# Altium project Shuttler_AMC.PrjPcb (part 4 of 20)

## Sheet POWER_Management.SchDoc: =ProjectName
size 420 x 297 mm; Author: T.P.; CompanyName: WUT; DrawnBy: T.P.; Organization: WUT ISE; Address1: Warsaw Univeristy of Technology; Address2: Nowowiejska 15/19; DocumentNumber: 24; Revision: 0.9; SheetNumber: 24; SheetTotal: 36; EDA_Number: ARTIQ; Projet: ARTIQ/SINARA; ModifiedBy: -; CreateDate: XX/XX/XXXX; CheckedDate: -; Title2: POWER_Management.SchDoc; DivGrp: ISE; Designer: G.K. and T.P.; ModifiedDate: -; ProjectName: ADC/DAC MEZZANINE
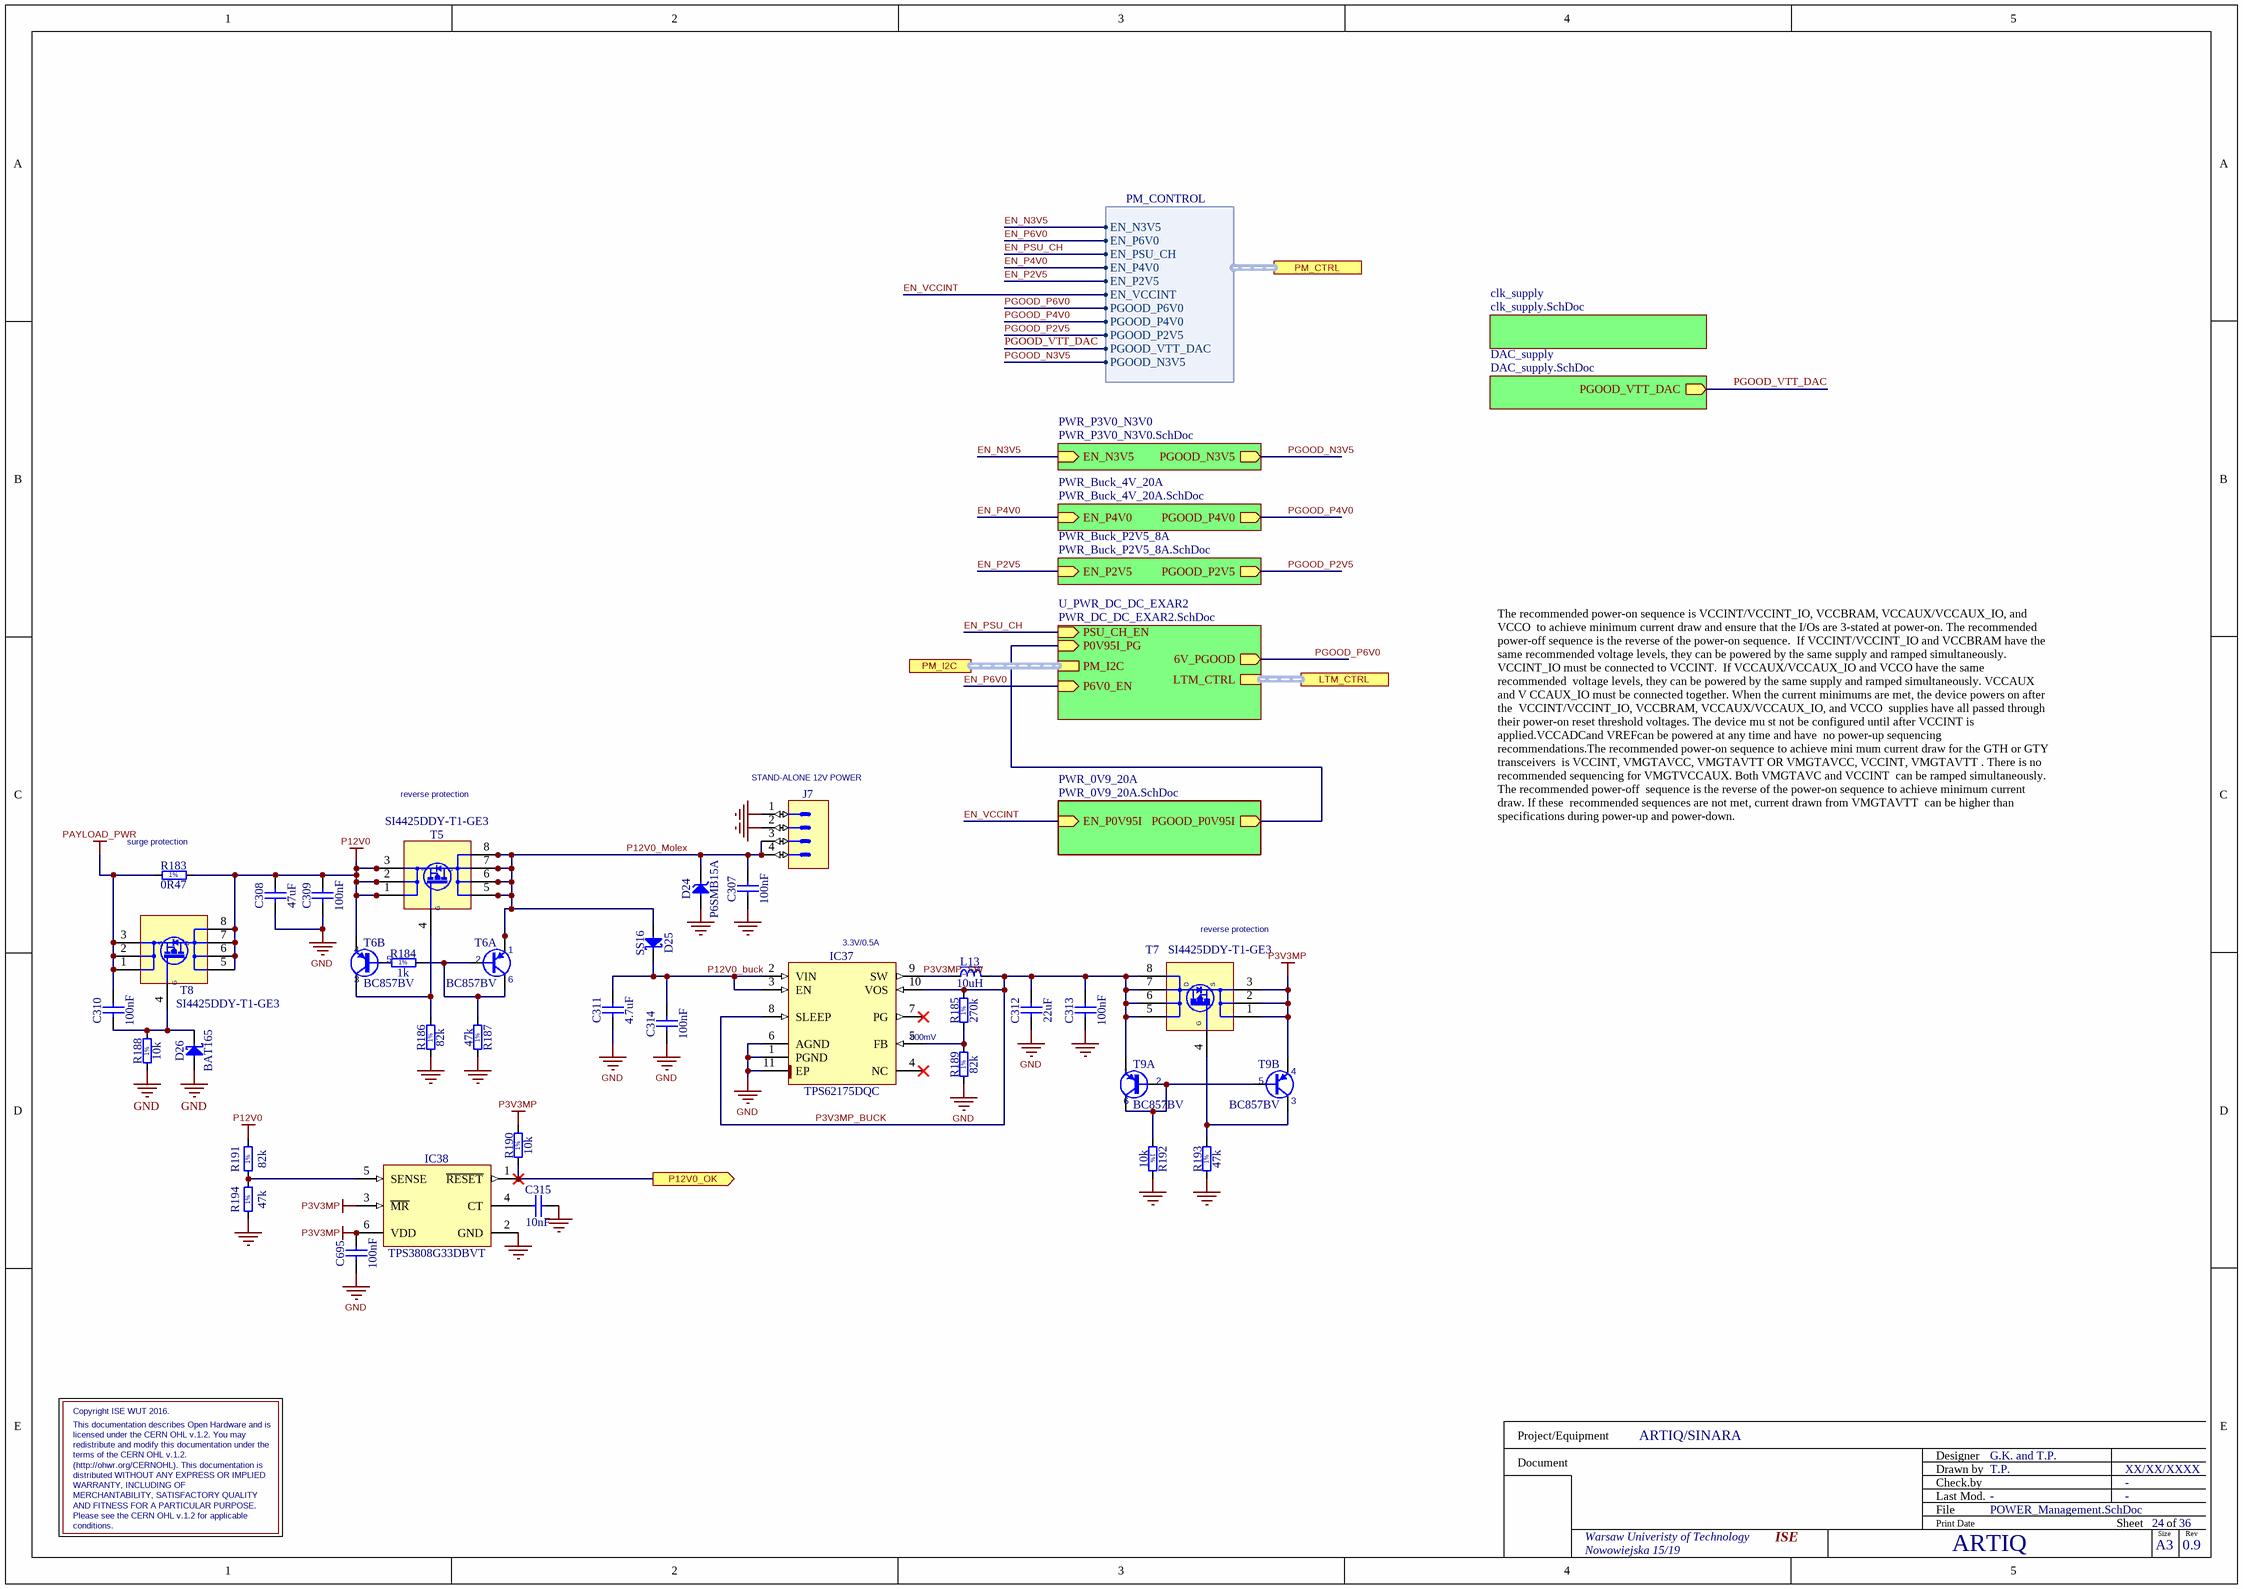
[diagram p5: POWER_Management.SchDoc]

### Parts
C307  100nF  [CAPC1005X55N]
C308  47uF  [CAPC3216X180N]
C309  100nF  [CAPC1005X55N]
C310  100nF  [CAPC1005X55N]
C311  4.7uF  [CAPC1709X95N]
C312  22uF  [CAPC2012X135N]
C313  100nF  [CAPC1005X55N]
C314  100nF  [CAPC1005X55N]
C315  10nF  [CAPC1005X55N]
C695  100nF  [CAPC1005X55N]
D24  P6SMB15A  [DIOM5436X261N]
D25  SS16  [DIOM5127X229N]
D26  BAT165  [SOD2512X110N]
IC37  TPS62175DQC  [SON50P200X300X80-11N-R94X250]
IC38  TPS3808G33DBVT  [SOT95P280X145-6N]
J7  Mini-Fit Jr.™  [MOLEX_39-28-1043]  (value not drawn)
L13  10uH  [IND_MURATA-PS_8400]
R183  0R47  [RESC3216X65N]
R184  1k  [RESC1005X40N]
R185  270k  [RESC1005X40N]
R186  82k  [RESC1005X40N]
R187  47k  [RESC1005X40N]
R188  10k  [RESC1005X40N]
R189  82k  [RESC1005X40N]
R190  10k  [RESC1005X40N]
R191  82k  [RESC1005X40N]
R192  10k  [RESC1005X40N]
R193  47k  [RESC1005X40N]
R194  47k  [RESC1005X40N]
T5  SI4425DDY-T1-GE3  [SOIC127P600X175-8N]
T6  BC857BV  [SOTFL50P160X60-6N]  (parts A,B of 2)
T7  SI4425DDY-T1-GE3  [SOIC127P600X175-8N]
T8  SI4425DDY-T1-GE3  [SOIC127P600X175-8N]
T9  BC857BV  [SOTFL50P160X60-6N]  (parts A,B of 2)

### Sub-sheets
clk_supply = clk_supply.SchDoc: no entries
DAC_supply = DAC_supply.SchDoc: PGOOD_VTT_DAC (out)
PWR_0V9_20A = PWR_0V9_20A.SchDoc: PGOOD_P0V95I (out), EN_P0V95I (in)  | CmpIndex: 17; SymIndex: 784
PWR_Buck_4V_20A = PWR_Buck_4V_20A.SchDoc: EN_P4V0 (in), PGOOD_P4V0 (out)
PWR_Buck_P2V5_8A = PWR_Buck_P2V5_8A.SchDoc: PGOOD_P2V5 (out), EN_P2V5 (in)
PWR_P3V0_N3V0 = PWR_P3V0_N3V0.SchDoc: PGOOD_N3V5 (out), EN_N3V5 (in)
U_PWR_DC_DC_EXAR2 = PWR_DC_DC_EXAR2.SchDoc: P0V95I_PG (in), PSU_CH_EN (in), LTM_CTRL (harness LTM_CTRL), PM_I2C (harness I2C), 6V_PGOOD (out), P6V0_EN (in)

### Ports
LTM_CTRL (harness LTM_CTRL), P12V0_OK (out), PM_CTRL (harness PM_CONTROL), PM_I2C (harness I2C)

### Harnesses
PM_CONTROL: EN_P6V0, EN_PSU_CH, EN_VCCINT, PGOOD_P6V0, EN_P2V5, EN_P4V0, PGOOD_P4V0, PGOOD_P2V5, PGOOD_VTT_DAC, EN_N3V5, PGOOD_N3V5

### Nets
GND: C307.1 C308.1 C309.1 C311.1 C312.1 C313.1 C314.1 C315.1 C695.1 D24.2(A) D26.2(A) IC37.1(PGND) IC37.6(AGND) IC37.11(EP) IC38.2(GND) J7.1 J7.2 R186.1 R187.1 R188.1 R189.1 R192.2 R193.1 R194.1
P3V3MP: C695.2 IC38.3(~{MR}) IC38.6(VDD) R190.2 T7.1(S) T7.2(S) T7.3(S) T9.4(E)
P12V0: C308.2 C309.2 R183.2 R191.2 T5.1(S) T5.2(S) T5.3(S) T6.4(E) T8.5(D) T8.6(D) T8.7(D) T8.8(D)
PAYLOAD_PWR: C310.2 R183.1 T8.1(S) T8.2(S) T8.3(S)
EN_N3V5: sheet PWR_P3V0_N3V0/EN_N3V5, port PM_CTRL.EN_N3V5
EN_P2V5: sheet PWR_Buck_P2V5_8A/EN_P2V5, port PM_CTRL.EN_P2V5
EN_P4V0: sheet PWR_Buck_4V_20A/EN_P4V0, port PM_CTRL.EN_P4V0
EN_P6V0: sheet U_PWR_DC_DC_EXAR2/P6V0_EN, port PM_CTRL.EN_P6V0
EN_PSU_CH: sheet U_PWR_DC_DC_EXAR2/PSU_CH_EN, port PM_CTRL.EN_PSU_CH
EN_VCCINT: sheet PWR_0V9_20A/EN_P0V95I, port PM_CTRL.EN_VCCINT
P0V95I_PG: sheet PWR_0V9_20A/PGOOD_P0V95I, sheet U_PWR_DC_DC_EXAR2/P0V95I_PG
P3V3MP_BUCK: C312.2 C313.2 IC37.8(SLEEP) IC37.10(VOS) L13.2 R185.2 T7.5(D) T7.6(D) T7.7(D) T7.8(D) T9.1(E)
P3V3MP_SW: IC37.9(SW) L13.1
P12V0_buck: C311.2 C314.2 D25.1(C) IC37.2(VIN) IC37.3(EN)
P12V0_Molex: C307.2 D24.1(C) D25.2(A) J7.3 J7.4 T5.5(D) T5.6(D) T5.7(D) T5.8(D) T6.1(E)
P12V0_OK: IC38.1(~{RESET}) R190.1 ; port P12V0_OK
PGOOD_N3V5: sheet PWR_P3V0_N3V0/PGOOD_N3V5, port PM_CTRL.PGOOD_N3V5
PGOOD_P2V5: sheet PWR_Buck_P2V5_8A/PGOOD_P2V5, port PM_CTRL.PGOOD_P2V5
PGOOD_P4V0: sheet PWR_Buck_4V_20A/PGOOD_P4V0, port PM_CTRL.PGOOD_P4V0
PGOOD_P6V0: sheet U_PWR_DC_DC_EXAR2/6V_PGOOD, port PM_CTRL.PGOOD_P6V0
PGOOD_VTT_DAC: sheet DAC_supply/PGOOD_VTT_DAC, port PM_CTRL.PGOOD_VTT_DAC
NetC310_1: C310.1 D26.1(C) R188.2 T8.4(S)
NetC315_2: C315.2 IC38.4(CT)
NetIC37_5: IC37.5(FB) R185.1 R189.2
NetIC38_5: IC38.5(SENSE) R191.1 R194.2
NetR184_1: R184.1 T6.5(B)
NetR184_2: R184.2 R187.2 T6.2(B) T6.6(C)
NetR186_2: R186.2 T5.4(S) T6.3(C)
NetR192_1: R192.1 T9.2(B) T9.5(B) T9.6(C)
NetR193_2: R193.2 T7.4(S) T9.3(C)

Not connected (* = marked no-connect by the designer): IC37 4(NC)* 7(PG)*

### Buses and harness runs
harness port LTM_CTRL = sheet U_PWR_DC_DC_EXAR2/LTM_CTRL
harness port PM_I2C = sheet U_PWR_DC_DC_EXAR2/PM_I2C

### Notes on the sheet
- reverse protection
- (near J7) STAND-ALONE 12V POWER
- (near R183) surge protection
- The recommended power-on sequence is VCCINT/VCCINT_IO, VCCBRAM, VCCAUX/VCCAUX_IO, and VCCO  to achieve minimum current draw and ensure that the I/Os are 3-stated at power-on. The recommended  power-off sequence is the reverse of the power-on sequence.  If VCCINT/VCCINT_IO and VCCBRAM have the  same recommended voltage levels, they can be powered by the same supply and ramped simultaneously.  VCCINT_IO must be connected to VCCINT.  If VCCAUX/VCCAUX_IO and VCCO have the same recommended  voltage levels, they can be powered by the same supply and ramped simultaneously. VCCAUX and V CCAUX_IO must be connected together. When the current minimums are met, the device powers on after the  VCCINT/VCCINT_IO, VCCBRAM, VCCAUX/VCCAUX_IO, and VCCO  supplies have all passed through their power-on reset threshold voltages. The device mu st not be configured until after VCCINT is applied.VCCADCand VREFcan be powered at any time and have  no power-up sequencing recommendations.The recommended power-on sequence to achieve mini mum current draw for the GTH or GTY transceivers  is VCCINT, VMGTAVCC, VMGTAVTT OR VMGTAVCC, VCCINT, VMGTAVTT . There is no recommended sequencing for VMGTVCCAUX. Both VMGTAVC and VCCINT  can be ramped simultaneously. The recommended power-off  sequence is the reverse of the power-on sequence to achieve minimum current draw. If these  recommended sequences are not met, current drawn from VMGTAVTT  can be higher than specifications during power-up and power-down.
- (near T7) reverse protection
- (near IC37) 3.3V/0.5A
- (near IC37) 800mV
- Copyright ISE WUT 2016.
- This documentation describes Open Hardware and is
- distributed WITHOUT ANY EXPRESS OR IMPLIED
- terms of the CERN OHL v.1.2.
- (http://ohwr.org/CERNOHL). This documentation is
- redistribute and modify this documentation under the
- licensed under the CERN OHL v.1.2. You may
- WARRANTY, INCLUDING OF
- AND FITNESS FOR A PARTICULAR PURPOSE.
- conditions.
- Please see the CERN OHL v.1.2 for applicable
- MERCHANTABILITY, SATISFACTORY QUALITY
- Project/Equipment
- Document
- Designer
- Drawn by
- Check.by
- File
- Last Mod.
- Print Date
- Sheet
- Size
- A3
- of
- Rev
- (in symbol R0402_1K_1%_0.0625W_100PPM) 1%
- (in symbol R0402_10K_1%_0.0625W_100PPM) 1%
- (in symbol R0402_47K_1%_0.0625W_100PPM) 1%
- (in symbol R0402_82K_1%_0.0625W_100PPM) 1%
- (in symbol R0402_270K_1%_0.0625W_100PPM) 1%
- (in symbol R1206_0R47_1%_0.5W_600PPM) 1%
- (in symbol SI4425DDY-T1-GE3) G

### Library data of the parts
C307 C309 C310 C313 C314 C695 = CC0402_100NF_16V_10%_X5R: Non-polarised capacitor; Manufacturer: GENERIC; Part Description: SMD Multilayer Chip Ceramic Capacitor; Manufacturer1 Part Number: GRM155R61C104KA88D; Tolerance: ±10%; Voltage: 16V; TC: X5R; Manufacturer Part Number: CC0402_100NF_16V_10%_X5R; Part Number: CC0402_100NF_16V_10%_X5R; Value: 100nF; Component Kind: Standard; Component Type: Standard; Pin Count: 2; Status: None; Case: 0402; Mounted: Yes; Socket: No; SMD: Yes; Sense: No; Manufacturer1 Example: MURATA; Manufacturer1 ComponentHeight: 0.55mm; HelpURL: \\cern.ch\dfs\Applications\Altium\Datasheets\CC0402_X5R_MURATA_GRM.pdf; Author: CERN DEM JLC; CreateDate: 10.12.2013; LatestRevisionDate: 10.12.2013
C308 = CC1206_47UF_25V_20%_X5R: Non-polarised capacitor; Manufacturer: GENERIC; Part Description: SMD Multilayer Chip Ceramic Capacitor; Manufacturer1 Part Number: C3216X5R1E476M160AC; Tolerance: ±20%; Voltage: 25V; TC: X5R; Manufacturer Part Number: CC1206_47UF_25V_20%_X5R; Part Number: CC1206_47UF_25V_20%_X5R; Value: 47uF; Component Kind: Standard; Component Type: Standard; Pin Count: 2; Status: None; Case: 1206; Mounted: Yes; Socket: No; SMD: Yes; Sense: No; Manufacturer1 Example: TDK; Manufacturer1 ComponentHeight: 1.8mm; HelpURL: \\cern.ch\dfs\Applications\Altium\Datasheets\CC1206_X5R_TDK_C.pdf; Author: CERN DEM JLC; CreateDate: 20.11.2013; LatestRevisionDate: 14.03.2017
C311 = CC0603_4.7UF_16V_10%_X5R: Non-polarised capacitor; Manufacturer: GENERIC; Part Description: SMD Multilayer Chip Ceramic Capacitor; Manufacturer1 Part Number: EMK107ABJ475KA-T; Tolerance: ±10%; Voltage: 16V; TC: X5R; Manufacturer Part Number: CC0603_4.7UF_16V_10%_X5R; Part Number: CC0603_4.7UF_16V_10%_X5R; Value: 4.7uF; Component Kind: Standard; Component Type: Standard; Pin Count: 2; Status: None; Case: 0603; Mounted: Yes; Socket: No; SMD: Yes; Sense: No; Manufacturer1 Example: TAIYO YUDEN; Manufacturer1 ComponentHeight: 0.95mm; HelpURL: \\cern.ch\dfs\Applications\Altium\Datasheets\CC0603_X7R_TAIYO-YUDEN_HIGH-VALUE.pdf; Author: CERN DEM JLC; CreateDate: 16.12.2013; LatestRevisionDate: 16.09.2014
C312 = CC0805_22UF_16V_10%_X5R: Non-polarised capacitor; Manufacturer: GENERIC; Part Description: SMD Multilayer Chip Ceramic Capacitor; Manufacturer1 Part Number: C2012X5R1C226KT; Tolerance: ±10%; Voltage: 16V; TC: X5R; Manufacturer Part Number: CC0805_22UF_16V_10%_X5R; Part Number: CC0805_22UF_16V_10%_X5R; Value: 22uF; Component Kind: Standard; Component Type: Standard; Pin Count: 2; Status: Preferred; Case: 0805; Mounted: Yes; Socket: No; SMD: Yes; Sense: No; Manufacturer1 Example: TDK; Manufacturer1 ComponentHeight: 1.35mm; HelpURL: \\cern.ch\dfs\Applications\Altium\Datasheets\CC0805_X5R_TDK_C.pdf; Author: CERN DEM JLC; CreateDate: 25.10.2012; LatestRevisionDate: 25.10.2012
C315 = CC0402_10NF_16V_10%_X7R: Non-polarised capacitor; Manufacturer: GENERIC; Part Description: SMD Multilayer Chip Ceramic Capacitor; Manufacturer1 Part Number: 223878715636; Tolerance: ±10%; Voltage: 16V; TC: X7R; Manufacturer Part Number: CC0402_10NF_16V_10%_X7R; Part Number: CC0402_10NF_16V_10%_X7R; Value: 10nF; Component Kind: Standard; Component Type: Standard; Pin Count: 2; Status: Not Recommended; Case: 0402; Mounted: Yes; Socket: No; SMD: Yes; Sense: No; Manufacturer1 Example: PHYCOMP; Manufacturer1 ComponentHeight: 0.55mm; HelpURL: \\cern.ch\dfs\Applications\Altium\Datasheets\CC0402_X7R_PHYCOMP.pdf; Author: CERN DEM JLC; CreateDate: 03.12.2007; LatestRevisionDate: 03.12.2007
D24 = P6SMB15A: Transient Voltage Suppressor Diode (Uni-Directional); Part Description: Uni-directional Transient Voltage Suppressor (TVS) Diode; Manufacturer: LITTELFUSE; Voltage: 15V; Power: 600W; PressFit: No; Bonding: No; Part Number: P6SMB15A; Component Kind: Standard; Component Type: Standard; Device: P6SMB15A; PackageDescription: DO-214-AA/SMB Diode, Molded Body; 5.40mm L X 3.62mm W X 2.61mm H, IPC Medium Density; Manufacturer Part Number: P6SMB15A; Pin Count: 2; Case: SMB; Mounted: Yes; Socket: No; SMD: Yes; Sense: No; ComponentHeight: 2.61mm; HelpURL: \\cern.ch\dfs\Applications\Altium\Datasheets\P6SMB15A.pdf; Author: CERN DEM JLC; CreateDate: 12.07.2017; LatestRevisionDate: 12.07.2017
D25 = SS16: Schottky Diode; Manufacturer: VISHAY GENERAL SEMICONDUCTOR; Part Description: Surface Mount Schottky Barrier Rectifier; Voltage: 60V; Power: 1A; PressFit: No; Bonding: No; Manufacturer Part Number: SS16; PackageDescription: DO-214-AC Molded Diode, Body 5.1x2.7mm, IPC Medium Density; Part Number: SS16; Component Kind: Standard; Component Type: Standard; Device: SS16; Pin Count: 2; Case: DO-214AC; Mounted: Yes; Socket: No; SMD: Yes; Sense: No; ComponentHeight: 2.29mm; HelpURL: \\cern.ch\dfs\Applications\Altium\Datasheets\SS16.pdf; Author: CERN DEM JLC; CreateDate: 15.07.2008; LatestRevisionDate: 23.08.2010
D26 = BAT165: Schottky Diode; Manufacturer: INFINEON; Part Description: Medium Power AF Schottky Diode; Voltage: 40V; Power: 750mA; PressFit: No; Bonding: No; Manufacturer Part Number: BAT165; PackageDescription: Small Outline Diode (SOD-323), 1.70mm W X 1.25mm L X 1.10mm H body,  IPC Medium Density; Part Number: BAT165; Component Kind: Standard; Component Type: Standard; Device: BAT165; Pin Count: 2; Case: SOD323; Mounted: Yes; Socket: No; SMD: Yes; Sense: No; ComponentHeight: 1.1mm; HelpURL: \\cern.ch\dfs\Applications\Altium\Datasheets\BAT165.pdf; Author: CERN DEM JLC; CreateDate: 12.11.2014; LatestRevisionDate: 12.11.2014
IC37 = TPS62175DQC: 4.75-28VDC to 1-6VDC, 500mA Step-Down Converter With Sleep Mode; Manufacturer: TEXAS INSTRUMENTS; PressFit: No; Bonding: No; Manufacturer Part Number: TPS62175DQC; PackageDescription: SON, 10-Leads, Body 2x3mm, Pitch 0.5mm, Thermal Pad 0.94x2.5mm, IPC Medium Density; Part Description: 4.75-28VDC to 1-6VDC, 500mA Step-Down Converter With Sleep Mode; Part Number: TPS62175DQC; Component Kind: Standard; Component Type: Standard; Device: TPS62175DQC; Pin Count: 11; Case: SON10; Mounted: Yes; Socket: No; SMD: Yes; Sense: No; ComponentHeight: 0.8mm; HelpURL: \\cern.ch\dfs\Applications\Altium\Datasheets\TPS62175DQC.pdf; Author: CERN DEM JMW; CreateDate: 11.08.2015; LatestRevisionDate: 11.08.2015
IC38 = TPS3808G33DBVT: Low Quiescent Current, Programmable-Delay Supervisory Circuit; Manufacturer: TEXAS INSTRUMENTS; Part Description: 3.3V, Low Quiescent Current, Programmable-Delay Supervisory Circuit; PressFit: No; Bonding: No; Manufacturer Part Number: TPS3808G33DBVT; PackageDescription: SOT23, 6-Leads, Body 1.6x3.0mm, Pitch 0.95mm, IPC Medium Density; Part Number: TPS3808G33DBVT; Component Kind: Standard; Component Type: Standard; Device: TPS3808G33DBVT; Pin Count: 6; Case: SOT23-6; Mounted: Yes; Socket: No; SMD: Yes; Sense: No; ComponentHeight: 1.45mm; Author: CERN DEM JLC; HelpURL: \\cern.ch\dfs\Applications\Altium\Datasheets\TPS3808G33DBVT.pdf; CreateDate: 05.11.2013; LatestRevisionDate: 05.11.2013
J7 = MOLEX_39-28-1043: Connector 4 Male; Manufacturer: MOLEX; Part Description: 4.20mm (.165") Pitch Mini-Fit Jr.™ Header, Dual Row, Vertical, without Snap-in Plastic Peg PCB Lock, 4 Circuits; PressFit: No; Manufacturer Part Number: 39-28-1043; Part Number: MOLEX_39-28-1043; Component Kind: Standard; Component Type: Standard; Pin Count: 4; Family: Mini-Fit Jr.™; Mounted: Yes; Socket: No; SMD: No; Sense: No; Status: None; ComponentHeight: 13.1mm; HelpURL: \\cern.ch\dfs\Applications\Altium\Datasheets\MOLEX_39-28-1043.pdf; Author: CERN DEM JLC; CreateDate: 12.03.2009; LatestRevisionDate: 06.03.2012
L13 = IND_10UH_10%_MURATA-PS_8400: Inductor With Core; Manufacturer Part Number: 84103C; Manufacturer: MURATA POWER SOLUTIONS; Part Description: Miniature Surface Mount Power Inductor (8400 Series); Tolerance: ±10%; Power: 950mA; Resistance: 0.24R; Part Number: IND_10UH_10%_MURATA-PS_8400; Value: 10uH; Component Kind: Standard; Component Type: Standard; Pin Count: 2; Status: None; Mounted: Yes; Socket: No; SMD: Yes; Sense: No; ComponentHeight: 2.9mm; HelpURL: \\cern.ch\dfs\Applications\Altium\Datasheets\IND_MURATA-PS_8400.pdf; Author: CERN DEM JLC; CreateDate: 02.07.2012; LatestRevisionDate: 02.07.2012
R183 = R1206_0R47_1%_0.5W_600PPM: Resistor - 1%; Part Description: Low Ohmique High Power Chip Resistor; Manufacturer: YAGEO PHYCOMP; Manufacturer Part Number: RL1206FR-7W0R47  (35051914707); Power: 0.5W; TC: ±600ppm/°C; PressFit: No; Part Number: R1206_0R47_1%_0.5W_600PPM; Component Kind: Standard; Component Type: Standard; Pin Count: 2; Value: 0R47; Status: Not Recommended; Tolerance: ±1%; Case: 1206; Mounted: Yes; Sense: No; Socket: No; SMD: Yes; ComponentHeight: 0.65mm; HelpURL: \\cern.ch\dfs\Applications\Altium\Datasheets\R1206_PHYCOMP_LRC02P.pdf; Author: CERN DEM JLC; CreateDate: 22.04.2010; LatestRevisionDate: 22.04.2010
R184 = R0402_1K_1%_0.0625W_100PPM: Resistor - 1%; Manufacturer: GENERIC; Part Description: General Purpose Thick Film Chip Resistor; Manufacturer1 Part Number: 232270671002L; TC: ±100ppm/°C; PressFit: No; Manufacturer Part Number: R0402_1K_1%_0.0625W_100PPM; Part Number: R0402_1K_1%_0.0625W_100PPM; Tolerance: ±1%; Value: 1k; Component Kind: Standard; Component Type: Standard; Pin Count: 2; Status: Not Recommended; Power: 0.0625W; Case: 0402; Mounted: Yes; Sense: No; Socket: No; SMD: Yes; Manufacturer1 Example: YAGEO PHYCOMP; Manufacturer1 ComponentHeight: 0.4mm; HelpURL: \\cern.ch\dfs\Applications\Altium\Datasheets\R0402_Phycomp_RC0402.pdf; Author: CERN DEM JLC; CreateDate: 03.12.2007; LatestRevisionDate: 17.10.2012
R185 = R0402_270K_1%_0.0625W_100PPM: Resistor - 1%; Manufacturer: GENERIC; Part Description: General Purpose Thick Film Chip Resistor; Manufacturer1 Part Number: 232270672704L; TC: ±100ppm/°C; PressFit: No; Manufacturer Part Number: R0402_270K_1%_0.0625W_100PPM; Part Number: R0402_270K_1%_0.0625W_100PPM; Tolerance: ±1%; Value: 270k; Component Kind: Standard; Component Type: Standard; Pin Count: 2; Status: Not Recommended; Power: 0.0625W; Case: 0402; Mounted: Yes; Sense: No; Socket: No; SMD: Yes; Manufacturer1 Example: YAGEO PHYCOMP; Manufacturer1 ComponentHeight: 0.4mm; HelpURL: \\cern.ch\dfs\Applications\Altium\Datasheets\R0402_Phycomp_RC0402.pdf; Author: CERN DEM JLC; CreateDate: 03.12.2007; LatestRevisionDate: 17.10.2012
R186 R189 R191 = R0402_82K_1%_0.0625W_100PPM: Resistor - 1%; Manufacturer: GENERIC; Part Description: General Purpose Thick Film Chip Resistor; Manufacturer1 Part Number: 232270678203L; TC: ±100ppm/°C; PressFit: No; Manufacturer Part Number: R0402_82K_1%_0.0625W_100PPM; Part Number: R0402_82K_1%_0.0625W_100PPM; Tolerance: ±1%; Value: 82k; Component Kind: Standard; Component Type: Standard; Pin Count: 2; Status: Not Recommended; Power: 0.0625W; Case: 0402; Mounted: Yes; Sense: No; Socket: No; SMD: Yes; Manufacturer1 Example: YAGEO PHYCOMP; Manufacturer1 ComponentHeight: 0.4mm; HelpURL: \\cern.ch\dfs\Applications\Altium\Datasheets\R0402_Phycomp_RC0402.pdf; Author: CERN DEM JLC; CreateDate: 03.12.2007; LatestRevisionDate: 17.10.2012
R187 R193 R194 = R0402_47K_1%_0.0625W_100PPM: Resistor - 1%; Manufacturer: GENERIC; Part Description: General Purpose Thick Film Chip Resistor; Manufacturer1 Part Number: 232270675103L; TC: ±100ppm/°C; PressFit: No; Manufacturer Part Number: R0402_47K_1%_0.0625W_100PPM; Part Number: R0402_47K_1%_0.0625W_100PPM; Tolerance: ±1%; Value: 47k; Component Kind: Standard; Component Type: Standard; Pin Count: 2; Status: Not Recommended; Power: 0.0625W; Case: 0402; Mounted: Yes; Sense: No; Socket: No; SMD: Yes; Manufacturer1 Example: YAGEO PHYCOMP; Manufacturer1 ComponentHeight: 0.4mm; HelpURL: \\cern.ch\dfs\Applications\Altium\Datasheets\R0402_Phycomp_RC0402.pdf; Author: CERN DEM JLC; CreateDate: 03.12.2007; LatestRevisionDate: 17.10.2012
R188 R190 R192 = R0402_10K_1%_0.0625W_100PPM: as R284 on sheet SDRAM_DDR3_4x16; Manufacturer Part Number: R0402_10K_1%_0.0625W_100PPM; Part Number: R0402_10K_1%_0.0625W_100PPM; Tolerance: ±1%; Value: 10k; Component Kind: Standard; Component Type: Standard; Pin Count: 2; Status: Not Recommended; Power: 0.0625W; Case: 0402; Mounted: Yes; Sense: No; Socket: No; SMD: Yes; Manufacturer1 Example: YAGEO PHYCOMP; Manufacturer1 ComponentHeight: 0.4mm; HelpURL: \\cern.ch\dfs\Applications\Altium\Datasheets\R0402_Phycomp_RC0402.pdf; Author: CERN DEM JLC; CreateDate: 03.12.2007; LatestRevisionDate: 17.10.2012
T5 T7 T8 = SI4425DDY-T1-GE3: -30V -19.7A P-Channel MOSFET; Manufacturer: VISHAY SILICONIX; PressFit: No; Bonding: No; Manufacturer Part Number: SI4425DDY-T1-GE3; PackageDescription: SOIC 8, Pitch 1.27mm - Body 4x5mm, IPC Medium Density; Part Description: -30V -19.7A P-Channel MOSFET; Part Number: SI4425DDY-T1-GE3; Component Kind: Standard; Component Type: Standard; Device: SI4425DDY-T1-GE3; Pin Count: 8; Case: SOIC8; Mounted: Yes; Socket: No; SMD: Yes; Sense: No; ComponentHeight: 1.75mm; HelpURL: \\cern.ch\dfs\Applications\Altium\Datasheets\SI4425DDY-T1-GE3.pdf; Author: CERN DEM MR; CreateDate: 05.10.2016; LatestRevisionDate: 05.10.2016
T6 T9 = BC857BV: 45V, 100mA PNP General Purpose Double Transistor; Manufacturer: NXP SEMICONDUCTORS; Part Description: -45V -100mA PNP General Purpose Double Transistor; PressFit: No; Bonding: No; Manufacturer Part Number: BC857BV; PackageDescription: SOTFL (SOT666), 0.50mm, Pitch; 6 Pin, 1.20mm W X 1.60mm L X 0.60mm H Body, IPC Medium Density; Part Number: BC857BV; Component Kind: Standard; Component Type: Standard; Device: BC857BV; Pin Count: 6; Case: SOT666; Mounted: Yes; Socket: No; SMD: Yes; Sense: No; ComponentHeight: 0.6mm; HelpURL: \\cern.ch\dfs\Applications\Altium\Datasheets\BC857BV.pdf; Author: CERN DEM JLC; CreateDate: 01.12.2011; LatestRevisionDate: 01.12.2011

## Sheet PWR_0V9_20A.SchDoc: =ProjectName
size 420 x 297 mm; Author: T.P.; CompanyName: WUT; DrawnBy: T.P.; Organization: WUT ISE; Address1: Warsaw Univeristy of Technology; Address2: Nowowiejska 15/19; DocumentNumber: 28; Revision: 0.9; SheetNumber: 28; SheetTotal: 36; EDA_Number: ARTIQ; Projet: ARTIQ/SINARA; ModifiedBy: -; CreateDate: XX/XX/XXXX; CheckedDate: -; Title2: PWR_0V9_20A.SchDoc; DivGrp: ISE; Designer: G.K. and T.P.; ModifiedDate: -; ProjectName: ADC/DAC MEZZANINE
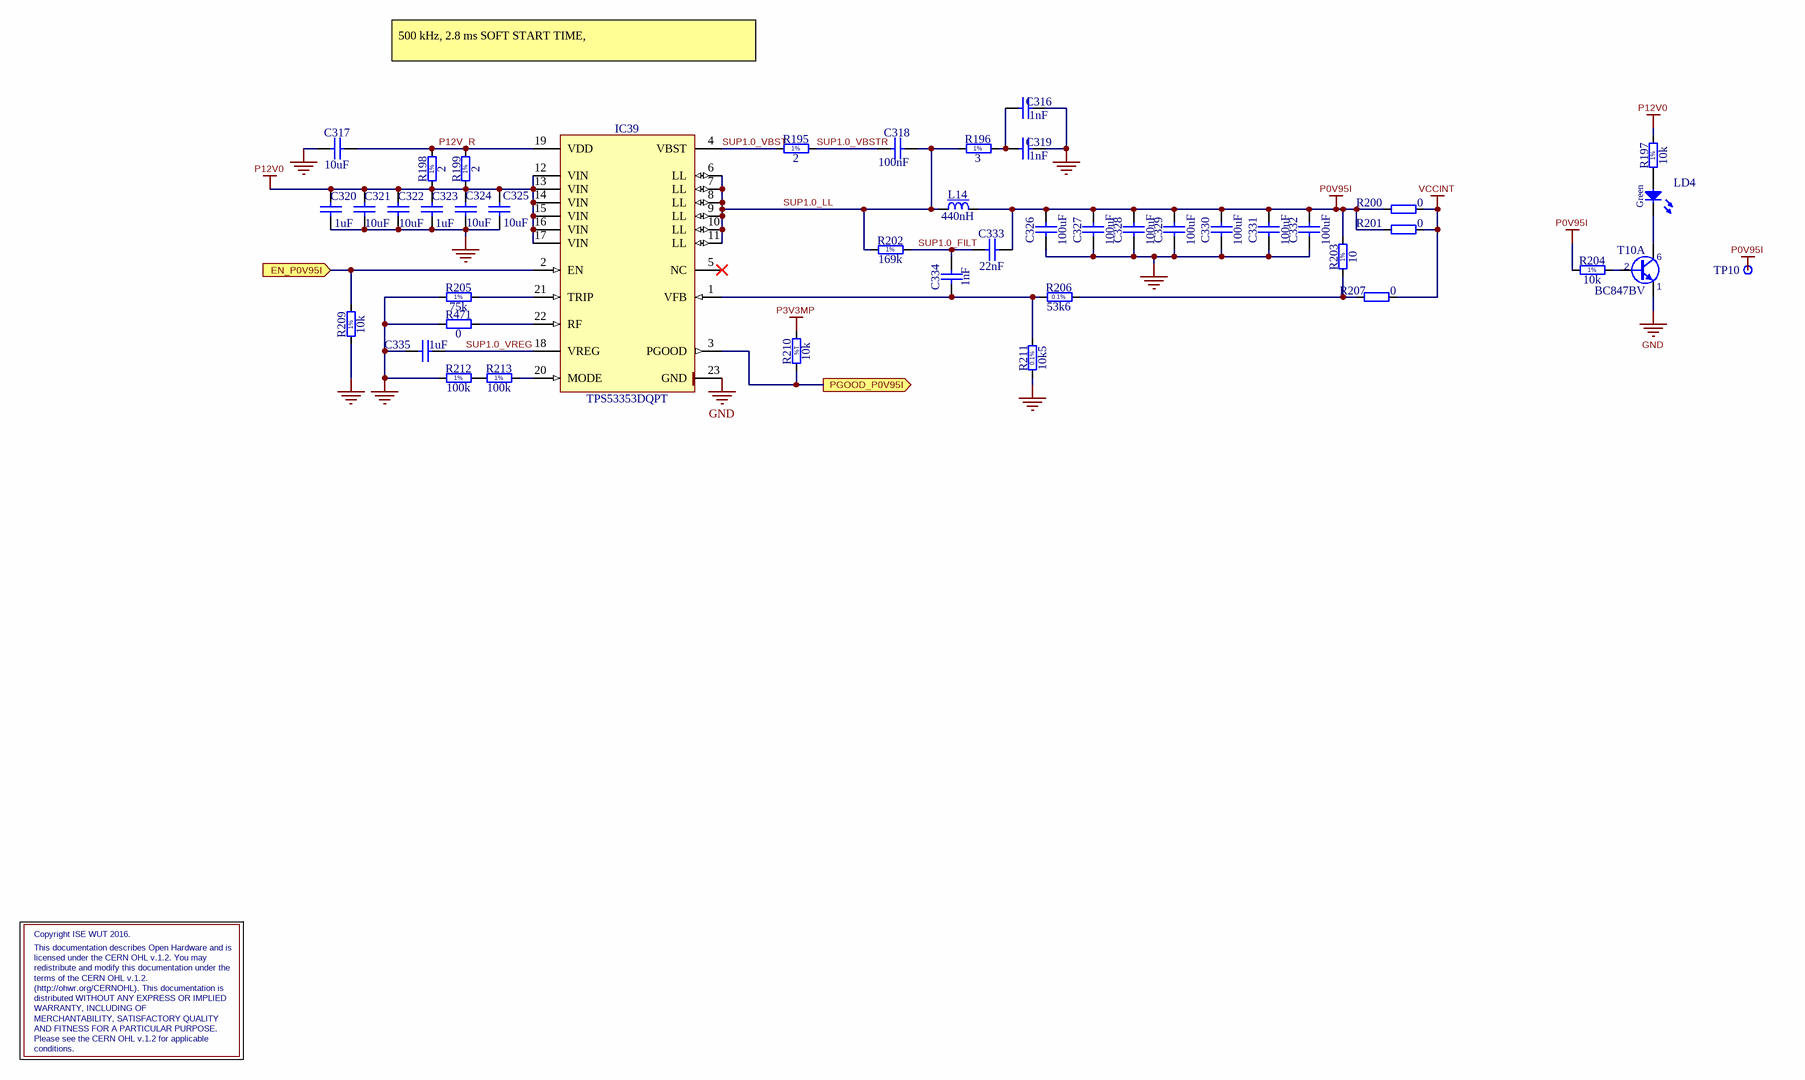
[diagram p6: PWR_0V9_20A.SchDoc]

### Parts
C316  1nF  [CAPC1005X55N]
C317  10uF  [CAPC3216X180N]
C318  100nF  [CAPC1005X55N]
C319  1nF  [CAPC1005X55N]
C320  1uF  [CAPC1608X87N]
C321  10uF  [CAPC3216X180N]
C322  10uF  [CAPC3216X180N]
C323  1uF  [CAPC1608X87N]
C324  10uF  [CAPC3216X180N]
C325  10uF  [CAPC3216X180N]
C326  100uF  [CAPC3216X180N]
C327  100uF  [CAPC3216X180N]
C328  100uF  [CAPC3216X180N]
C329  100uF  [CAPC3216X180N]
C330  100uF  [CAPC3216X180N]
C331  100uF  [CAPC3216X180N]
C332  100uF  [CAPC3216X180N]
C333  22nF  [CAPC1608X87N]
C334  1nF  [CAPC1005X55N]
C335  1uF  [CAPC1608X87N]
IC39  TPS53353DQPT  [SON50P500X600X150-23N-R334X557]
L14  440nH  [IND_PULSE_PA0513]
LD4  Green  [LED_OSRAM_LGL29K]
R195  2  [RESC1608X55N]
R196  3  [RESC3216X65N]
R197  10k  [RESC1005X40N]
R198  2  [RESC1608X55N]
R199  2  [RESC1608X55N]
R200  0  [RESC6331X70N]
R201  0  [RESC6331X70N]
R202  169k  [RESC1608X55N]
R203  10  [RESC1005X40N]
R204  10k  [RESC1005X40N]
R205  75k  [RESC1005X40N]
R206  53k6  [RESC1608X55N]
R207  0  [RESC6331X70N]
R209  10k  [RESC1005X40N]
R210  10k  [RESC1005X40N]
R211  10k5  [RESC1608X55N]
R212  100k  [RESC1005X40N]
R213  100k  [RESC1005X40N]
R471  0  [RESC1005X40N]
T10  BC847BV  [SOTFL50P160X60-6N]  (part A of 2)
TP10  Test Point  [TPS127]  (value not drawn)

### Ports
EN_P0V95I (in), PGOOD_P0V95I (out)

### Nets
GND: C316.2 C317.2 C319.2 C320.1 C321.1 C322.1 C323.1 C324.1 C325.1 C326.1 C327.1 C328.1 C329.1 C330.1 C331.1 C332.1 C335.2 IC39.23(GND) R205.1 R209.2 R211.1 R212.1 R471.1 T10.1(E)
P0V95I: C326.2 C327.2 C328.2 C329.2 C330.2 C331.2 C332.2 C333.2 L14.2 R200.1 R201.1 R203.2 R204.1 TP10.1
P3V3MP: R210.2
P12V0: C320.2 C321.2 C322.2 C323.2 C324.2 C325.2 IC39.12(VIN) IC39.13(VIN) IC39.14(VIN) IC39.15(VIN) IC39.16(VIN) IC39.17(VIN) R197.2 R198.1 R199.1
VCCINT: R200.2 R201.2 R207.2
EN_VCCINT: IC39.2(EN) R209.1 ; port EN_P0V95I
P0V95I_PG: IC39.3(PGOOD) R210.1 ; port PGOOD_P0V95I
P12V_R: C317.1 IC39.19(VDD) R198.2 R199.2
SUP1.0_FILT: C333.1 C334.2 R202.2
SUP1.0_LL: C318.2 IC39.6(LL) IC39.7(LL) IC39.8(LL) IC39.9(LL) IC39.10(LL) IC39.11(LL) L14.1 R196.1 R202.1
SUP1.0_VBST: IC39.4(VBST) R195.1
SUP1.0_VBSTR: C318.1 R195.2
SUP1.0_VREG: C335.1 IC39.18(VREG)
NetC316_1: C316.1 C319.1 R196.2
NetC334_1: C334.1 IC39.1(VFB) R206.1 R211.2
NetIC39_20: IC39.20(MODE) R213.2
NetIC39_21: IC39.21(TRIP) R205.2
NetIC39_22: IC39.22(RF) R471.2
NetLD4_1: LD4.1(C) T10.6(C)
NetLD4_2: LD4.2(A) R197.1
NetR203_1: R203.1 R206.2 R207.1
NetR204_2: R204.2 T10.2(B)
NetR212_2: R212.2 R213.1

Not connected (* = marked no-connect by the designer): IC39 5(NC)*

### Notes on the sheet
- 500 kHz, 2.8 ms SOFT START TIME,
- Copyright ISE WUT 2016.
- (http://ohwr.org/CERNOHL). This documentation is
- distributed WITHOUT ANY EXPRESS OR IMPLIED
- This documentation describes Open Hardware and is
- terms of the CERN OHL v.1.2.
- licensed under the CERN OHL v.1.2. You may
- redistribute and modify this documentation under the
- conditions.
- AND FITNESS FOR A PARTICULAR PURPOSE.
- MERCHANTABILITY, SATISFACTORY QUALITY
- Please see the CERN OHL v.1.2 for applicable
- WARRANTY, INCLUDING OF
- Project/Equipment
- Document
- Designer
- Drawn by
- Check.by
- File
- Last Mod.
- Print Date
- Sheet
- Size
- A3
- of
- Rev
- (in symbol R0402_10K_1%_0.0625W_100PPM) 1%
- (in symbol R0402_10R_1%_0.0625W_200PPM) 1%
- (in symbol R0402_75K_1%_0.0625W_100PPM) 1%
- (in symbol R0402_100K_1%_0.0625W_100PPM) 1%
- (in symbol R0603_2R_1%_0.1W_200PPM) 1%
- (in symbol R0603_10K5_0.1%_0.063W_10PPM) 0.1%
- (in symbol R0603_53K6_0.1%_0.063W_10PPM) 0.1%
- (in symbol R0603_169K_1%_0.1W_100PPM) 1%
- (in symbol R1206_3R_1%_0.25W_200PPM) 1%

### Library data of the parts
C316 C319 C334 = CC0402_1NF_50V_10%_X7R: Non-polarised capacitor; Manufacturer: GENERIC; Part Description: SMD Multilayer Chip Ceramic Capacitor; Manufacturer1 Part Number: 223858715623; Tolerance: ±10%; Voltage: 50V; TC: X7R; Manufacturer Part Number: CC0402_1NF_50V_10%_X7R; Part Number: CC0402_1NF_50V_10%_X7R; Value: 1nF; Component Kind: Standard; Component Type: Standard; Pin Count: 2; Status: Not Recommended; Case: 0402; Mounted: Yes; Socket: No; SMD: Yes; Sense: No; Manufacturer1 Example: PHYCOMP; Manufacturer1 ComponentHeight: 0.55mm; HelpURL: \\cern.ch\dfs\Applications\Altium\Datasheets\CC0402_X7R_PHYCOMP.pdf; Author: CERN DEM JLC; CreateDate: 03.12.2007; LatestRevisionDate: 03.12.2007
C317 C321 C322 C324 C325 = CC1206_10uF_25V_10%_X7R: Non-polarised capacitor; Manufacturer: GENERIC; Part Description: SMD Multilayer Chip Ceramic Capacitor; Manufacturer1 Part Number: C1206C106K4RACTU; Tolerance: ±10%; Voltage: 25V; TC: X7R; Manufacturer Part Number: CC1206_10uF_25V_10%_X7R; Part Number: CC1206_10UF_25V_10%_X7R; Value: 10uF; Component Kind: Standard; Component Type: Standard; Pin Count: 2; Status: Preferred; Case: 1206; Mounted: Yes; Socket: No; SMD: Yes; Sense: No; Manufacturer1 Example: KEMET; Manufacturer1 ComponentHeight: 1.8mm; HelpURL: \\cern.ch\dfs\Applications\Altium\Datasheets\CC1206_X7R_KEMET.pdf; Author: CERN DEM JLC; CreateDate: 12.09.2012; LatestRevisionDate: 12.09.2012
C318 = CC0402_100NF_16V_10%_X5R: as C307 on sheet POWER_Management; Manufacturer Part Number: CC0402_100NF_16V_10%_X5R; Part Number: CC0402_100NF_16V_10%_X5R; Value: 100nF; Component Kind: Standard; Component Type: Standard; Pin Count: 2; Status: None; Case: 0402; Mounted: Yes; Socket: No; SMD: Yes; Sense: No; Manufacturer1 Example: MURATA; Manufacturer1 ComponentHeight: 0.55mm; HelpURL: \\cern.ch\dfs\Applications\Altium\Datasheets\CC0402_X5R_MURATA_GRM.pdf; Author: CERN DEM JLC; CreateDate: 10.12.2013; LatestRevisionDate: 10.12.2013
C320 C323 C335 = CC0603_1UF_25V_10%_X7R: Non-polarised capacitor; Manufacturer: GENERIC; Part Description: SMD Multilayer Chip Ceramic Capacitor; Manufacturer1 Part Number: GRM188R71E105KA12D; Tolerance: ±10%; Voltage: 25V; TC: X7R; Manufacturer Part Number: CC0603_1UF_25V_10%_X7R; Part Number: CC0603_1UF_25V_10%_X7R; Value: 1uF; Component Kind: Standard; Component Type: Standard; Pin Count: 2; Status: None; Case: 0603; Mounted: Yes; Socket: No; SMD: Yes; Sense: No; Manufacturer1 Example: MURATA; Manufacturer1 ComponentHeight: 0.9mm; HelpURL: \\cern.ch\dfs\Applications\Altium\Datasheets\CC0603_X7R_MURATA.pdf; Author: CERN DEM JLC; CreateDate: 18.01.2011; LatestRevisionDate: 18.01.2011
C326-C332 = CC1206_100UF_6.3V_20%_X5R: Non-polarised capacitor; Manufacturer: GENERIC; Part Description: SMD Multilayer Chip Ceramic Capacitor; Manufacturer1 Part Number: C1206C107M9PACTU; Tolerance: ±10%; Voltage: 6.3V; TC: X5R; Manufacturer Part Number: CC1206_100UF_6.3V_20%_X5R; Part Number: CC1206_100UF_6.3V_20%_X5R; Value: 100uF; Component Kind: Standard; Component Type: Standard; Pin Count: 2; Status: None; Case: 1206; Mounted: Yes; Socket: No; SMD: Yes; Sense: No; Manufacturer1 Example: KEMET; Manufacturer1 ComponentHeight: 1.8mm; HelpURL: \\cern.ch\dfs\Applications\Altium\Datasheets\CC1206_X5R_KEMET.pdf; Author: CERN DEM JLC; CreateDate: 26.09.2012; LatestRevisionDate: 26.09.2012
C333 = CC0603_22NF_50V_10%_X7R: Non-polarised capacitor; Manufacturer: GENERIC; Part Description: SMD Multilayer Chip Ceramic Capacitor; Manufacturer1 Part Number: 223858615641; Tolerance: ±10%; Voltage: 50V; TC: X7R; Manufacturer Part Number: CC0603_22NF_50V_10%_X7R; Part Number: CC0603_22NF_50V_10%_X7R; Value: 22nF; Component Kind: Standard; Component Type: Standard; Pin Count: 2; Status: Preferred; Case: 0603; Mounted: Yes; Socket: No; SMD: Yes; Sense: No; Manufacturer1 Example: PHYCOMP; Manufacturer1 ComponentHeight: 0.87mm; HelpURL: \\cern.ch\dfs\Applications\Altium\Datasheets\CC0603_X7R_PHYCOMP.pdf; Author: CERN DEM JLC; CreateDate: 03.12.2007; LatestRevisionDate: 03.12.2007
IC39 = TPS53353DQPT: 1.5V to 15V Input (4.5V to 25V Bias), 20A Synchronous Buck SWIFT™ Converter with Eco-mode™; Manufacturer: TEXAS INSTRUMENTS; Autho: TP; PressFit: No; Bonding: No; Mounted: Yes; Part Number: TPS53353DQPT; Pin Count: 23; Socket: No; Sense: No; SMD: Yes; Case: SON22; Component Kind: Standard; Component Type: Standard; ComponentHeight: 1.5mm; CreateDate: 17.01.2019; Device: TPS53353DQPT; Manufacturer Part Number: TPS53353DQPT; PackageDescription: SON, 0.50mm Pitch; 22 Pin, 5.00mm W X 6.00mm L X 1.50mm H Body (w/Thermal Tab 3.34 X 5.57mm), IPC Medium Density; Part Description: 1.5V to 15V Input (4.5V to 25V Bias), 20A Synchronous Buck SWIFT™ Converter with Eco-mode™
L14 = IND_440NH_20%_PULSE_PA0513.441NLT: Inductor With Core; Manufacturer: PULSE ELECTRONICS; Part Description: SMT Power Inductor; Tolerance: ±20%; Power: 30A; Resistance: 0.0032R; Manufacturer Part Number: PA0513.441NLT; Part Number: IND_440NH_20%_PULSE_PA0513.441NLT; Value: 440nH; Component Kind: Standard; Component Type: Standard; Pin Count: 2; Status: None; Mounted: Yes; Socket: No; SMD: Yes; Sense: No; ComponentHeight: 8mm; HelpURL: \\cern.ch\dfs\Applications\Altium\Datasheets\IND_PULSE_PA0513.441NLT.pdf; Author: CERN DEM JLC; CreateDate: 15.11.2016; LatestRevisionDate: 15.11.2016
LD4 = LED_OSRAM_LG L29K-G2J1-24-Z: LED Green 1C 2A; Manufacturer: OSRAM; Part Description: Surface Mount Green LED (0603 Case); Bonding: No; PressFit: No; Status Comment: Sourcing Difficulty; Author: CERN DEM JLC; Case: 0603; Color: Green; Component Kind: Standard; Component Type: Standard; ComponentHeight: 0.67mm; CreateDate: 24.04.2012; HelpURL: \\cern.ch\dfs\Applications\Altium\Datasheets\LED_OSRAM_LGL29K.pdf; LatestRevisionDate: 24.04.2012; Manufacturer Part Number: LG L29K-G2J1-24-Z; Mounted: Yes; PackageDescription: Green Chip LED, 2-Leads, Body 1.7x0.8mm, IPC Medium Density; Part Number: LED_OSRAM_LG L29K-G2J1-24-Z; Pin Count: 2; SMD: Yes; Socket: No; Status: Not Recommended; Sense: No
R195 R198 R199 = R0603_2R_1%_0.1W_200PPM: Resistor - 1%; Manufacturer: GENERIC; Part Description: General Purpose Thick Film Chip Resistor; Manufacturer1 Part Number: 232270462008L or RC0603FR-072RL; Power: 0.1W; TC: ±200ppm/°C; PressFit: No; Manufacturer Part Number: R0603_2R_1%_0.1W_200PPM; Part Number: R0603_2R_1%_0.1W_200PPM; Tolerance: ±1%; Value: 2; Component Kind: Standard; Component Type: Standard; Pin Count: 2; Status: Preferred; Case: 0603; Mounted: Yes; Sense: No; Socket: No; SMD: Yes; Manufacturer1 Example: YAGEO PHYCOMP; Manufacturer1 ComponentHeight: 0.65mm; HelpURL: \\cern.ch\dfs\Applications\Altium\Datasheets\R0603_Tyco_RN73.pdf; Author: CERN DEM JLC; CreateDate: 03.12.2007; LatestRevisionDate: 17.10.2012
R196 = R1206_3R_1%_0.25W_200PPM: Resistor - 1%; Manufacturer: GENERIC; Part Description: General Purpose Thick Film Chip Resistor; Manufacturer1 Part Number: 232272463008; Power: 0.25W; TC: ±200ppm/°C; PressFit: No; Manufacturer Part Number: R1206_3R_1%_0.25W_200PPM; Part Number: R1206_3R_1%_0.25W_200PPM; Tolerance: ±1%; Value: 3; Component Kind: Standard; Component Type: Standard; Pin Count: 2; Status: Preferred; Case: 1206; Mounted: Yes; Sense: No; Socket: No; SMD: Yes; Manufacturer1 Example: PHYCOMP; Manufacturer1 ComponentHeight: 0.65mm; HelpURL: \\cern.ch\dfs\Applications\Altium\Datasheets\R1206_Phycomp_RC1206.pdf; Author: CERN DEM JLC; CreateDate: 03.12.2007; LatestRevisionDate: 24.06.2009
R197 = R0402_10K_1%_0.0625W_100PPM: as R161 on sheet JTAG_Configuration; Part Number: R0402_10K_1%_0.0625W_100PPM; Component Kind: Standard; Component Type: Standard; Pin Count: 2; Value: 10k; Status: Not Recommended; Power: 0.0625W; Tolerance: ±1%; Manufacturer Part Number: R0402_10K_1%_0.0625W_100PPM; Case: 0402; Mounted: Yes; Sense: No; Socket: No; SMD: Yes; Manufacturer1 Example: YAGEO PHYCOMP; Manufacturer1 ComponentHeight: 0.4mm; HelpURL: \\cern.ch\dfs\Applications\Altium\Datasheets\R0402_Phycomp_RC0402.pdf; Author: CERN DEM JLC; CreateDate: 03.12.2007; LatestRevisionDate: 17.10.2012
R200 R201 R207 = R2512_0R_JUMPER: Resistor; Manufacturer: GENERIC; Part Description: 16A (0.005R Max DC Resistance) Zero Ohm Jumper; Manufacturer1 Part Number: CRCW25120000Z0EG; PressFit: No; Manufacturer Part Number: R2512_0R_JUMPER; Part Number: R2512_0R_JUMPER; Value: 0; Component Kind: Standard; Component Type: Standard; Pin Count: 2; Status: Preferred; Case: 2512; Mounted: Yes; Sense: No; Socket: No; SMD: Yes; Manufacturer1 Example: VISHAY DRALORIC; Manufacturer1 ComponentHeight: 0.7mm; HelpURL: \\cern.ch\dfs\Applications\Altium\Datasheets\R2512_VISHAY_CRCW-HP E3.pdf; Author: CERN DEM JLC; CreateDate: 17.09.2014; LatestRevisionDate: 17.09.2014
R202 = R0603_169K_1%_0.1W_100PPM: Resistor - 1%; Manufacturer: GENERIC; Part Description: General Purpose Thick Film Chip Resistor; Manufacturer1 Part Number: CRCW0603169KFKEA; Power: 0.1W; TC: ±100ppm/°C; PressFit: No; Manufacturer Part Number: R0603_169K_1%_0.1W_100PPM; Part Number: R0603_169k_1%_0.1W_100PPM; Tolerance: ±1%; Value: 169k; Component Kind: Standard; Component Type: Standard; Pin Count: 2; Status: Preferred; Case: 0603; Mounted: Yes; Sense: No; Socket: No; SMD: Yes; Manufacturer1 Example: VISHAY; Manufacturer1 ComponentHeight: 0.50mm; HelpURL: \\cern.ch\dfs\Applications\Altium\Datasheets\R0603_VISHAY_CRCW e3.pdf; Author: CERN DEM JLC; CreateDate: 17.03.2014; LatestRevisionDate: 17.03.2014
R203 = R0402_10R_1%_0.0625W_200PPM: as R285 on sheet SDRAM_DDR3_4x16; Manufacturer Part Number: R0402_10R_1%_0.0625W_200PPM; Part Number: R0402_10R_1%_0.0625W_200PPM; Tolerance: ±1%; Value: 10; Component Kind: Standard; Component Type: Standard; Pin Count: 2; Status: Not Recommended; Power: 0.0625W; Case: 0402; Mounted: Yes; Sense: No; Socket: No; SMD: Yes; Manufacturer1 Example: YAGEO PHYCOMP; Manufacturer1 ComponentHeight: 0.4mm; HelpURL: \\cern.ch\dfs\Applications\Altium\Datasheets\R0402_Phycomp_RC0402.pdf; Author: CERN DEM JLC; CreateDate: 24.06.2009; LatestRevisionDate: 17.10.2012
R204 R209 R210 = R0402_10K_1%_0.0625W_100PPM: as R284 on sheet SDRAM_DDR3_4x16; Manufacturer Part Number: R0402_10K_1%_0.0625W_100PPM; Part Number: R0402_10K_1%_0.0625W_100PPM; Tolerance: ±1%; Value: 10k; Component Kind: Standard; Component Type: Standard; Pin Count: 2; Status: Not Recommended; Power: 0.0625W; Case: 0402; Mounted: Yes; Sense: No; Socket: No; SMD: Yes; Manufacturer1 Example: YAGEO PHYCOMP; Manufacturer1 ComponentHeight: 0.4mm; HelpURL: \\cern.ch\dfs\Applications\Altium\Datasheets\R0402_Phycomp_RC0402.pdf; Author: CERN DEM JLC; CreateDate: 03.12.2007; LatestRevisionDate: 17.10.2012
R205 = R0402_75K_1%_0.0625W_100PPM: Resistor - 1%; Manufacturer: GENERIC; Part Description: General Purpose Thick Film Chip Resistor; Manufacturer1 Part Number: 232270677503L; TC: ±100ppm/°C; PressFit: No; Manufacturer Part Number: R0402_75K_1%_0.0625W_100PPM; Part Number: R0402_75K_1%_0.0625W_100PPM; Tolerance: ±1%; Value: 75k; Component Kind: Standard; Component Type: Standard; Pin Count: 2; Status: Not Recommended; Power: 0.0625W; Case: 0402; Mounted: Yes; Sense: No; Socket: No; SMD: Yes; Manufacturer1 Example: YAGEO PHYCOMP; Manufacturer1 ComponentHeight: 0.4mm; HelpURL: \\cern.ch\dfs\Applications\Altium\Datasheets\R0402_Phycomp_RC0402.pdf; Author: CERN DEM JLC; CreateDate: 03.12.2007; LatestRevisionDate: 17.10.2012
R206 = R0603_53K6_0.1%_0.063W_10PPM: Resistor - 0.1%; Part Description: Thin Film Chip Resistor; Manufacturer: GENERIC; Manufacturer1 Part Number: RN73C1J53K6BTDF; Power: 0.063W; TC: ±10ppm; PressFit: No; Part Number: R0603_53K6_0.1%_0.063W_10PPM; Component Kind: Standard; Component Type: Standard; Pin Count: 2; Value: 53k6; Status: Not Recommended; Tolerance: ±0.1%; Manufacturer Part Number: R0603_53K6_0.1%_0.063W_10PPM; Case: 0603; Mounted: Yes; Sense: No; Socket: No; SMD: Yes; Manufacturer1 Example: TYCO HOLSWORTHY; Manufacturer1 ComponentHeight: 0.5mm; HelpURL: \\cern.ch\dfs\Applications\Altium\Datasheets\R0603_Tyco_RN73.pdf; Author: CERN DEM JLC; CreateDate: 03.12.2007; LatestRevisionDate: 13.03.2008
R211 = R0603_10K5_0.1%_0.063W_10PPM: Resistor - 0.1%; Part Description: Thin Film Chip Resistor; Manufacturer: GENERIC; Manufacturer1 Part Number: RN73C1J10K5BTDF; Power: 0.063W; TC: ±10ppm; PressFit: No; Part Number: R0603_10K5_0.1%_0.063W_10PPM; Component Kind: Standard; Component Type: Standard; Pin Count: 2; Value: 10k5; Status: Not Recommended; Tolerance: ±0.1%; Manufacturer Part Number: R0603_10K5_0.1%_0.063W_10PPM; Case: 0603; Mounted: Yes; Sense: No; Socket: No; SMD: Yes; Manufacturer1 Example: TYCO HOLSWORTHY; Manufacturer1 ComponentHeight: 0.5mm; HelpURL: \\cern.ch\dfs\Applications\Altium\Datasheets\R0603_Tyco_RN73.pdf; Author: CERN DEM JLC; CreateDate: 03.12.2007; LatestRevisionDate: 13.03.2008
R212 R213 = R0402_100K_1%_0.0625W_100PPM: Resistor - 1%; Manufacturer: GENERIC; Part Description: General Purpose Thick Film Chip Resistor; Manufacturer1 Part Number: 232270671004L; TC: ±100ppm/°C; PressFit: No; Manufacturer Part Number: R0402_100K_1%_0.0625W_100PPM; Part Number: R0402_100K_1%_0.0625W_100PPM; Tolerance: ±1%; Value: 100k; Component Kind: Standard; Component Type: Standard; Pin Count: 2; Status: Not Recommended; Power: 0.0625W; Case: 0402; Mounted: Yes; Sense: No; Socket: No; SMD: Yes; Manufacturer1 Example: YAGEO PHYCOMP; Manufacturer1 ComponentHeight: 0.4mm; HelpURL: \\cern.ch\dfs\Applications\Altium\Datasheets\R0402_Phycomp_RC0402.pdf; Author: CERN DEM JLC; CreateDate: 03.12.2007; LatestRevisionDate: 17.10.2012
R471 = R0402_0R_JUMPER: Resistor; Part Description: 1A (0.05R Max DC Resistance) Zero Ohm Jumper; Manufacturer: GENERIC; Manufacturer1 Part Number: 232270591001L; PressFit: No; Part Number: R0402_0R_JUMPER; Component Kind: Standard; Component Type: Standard; Pin Count: 2; Value: 0; Status: Not Recommended; Manufacturer Part Number: R0402_0R_JUMPER; Case: 0402; Mounted: Yes; Sense: No; Socket: No; SMD: Yes; Manufacturer1 Example: YAGEO PHYCOMP; Manufacturer1 ComponentHeight: 0.4mm; HelpURL: \\cern.ch\dfs\Applications\Altium\Datasheets\R0402_Phycomp_RC0402.pdf; Author: CERN DEM JLC; CreateDate: 03.12.2007; LatestRevisionDate: 17.10.2012
T10 = BC847BV: 45V, 100mA NPN General Purpose Double Transistor; Manufacturer: NXP SEMICONDUCTORS; Part Description: 45V 100mA NPN General Purpose Double Transistor; PressFit: No; Bonding: No; Manufacturer Part Number: BC847BV; PackageDescription: SOTFL (SOT666), 0.50mm, Pitch; 6 Pin, 1.20mm W X 1.60mm L X 0.60mm H Body, IPC Medium Density; Part Number: BC847BV; Component Kind: Standard; Component Type: Standard; Device: BC847BV; Pin Count: 6; Case: SOT666; Mounted: Yes; Socket: No; SMD: Yes; Sense: No; ComponentHeight: 0.6mm; HelpURL: \\cern.ch\dfs\Applications\Altium\Datasheets\BC847BV.pdf; Author: CERN DEM JLC; CreateDate: 01.12.2011; LatestRevisionDate: 01.12.2011
TP10 = SMD_PAD_1.27X1.27MM: Part Description: 1.27mm x 1.27mm PCB Copper Area (SMD Test Point); Mounted: No; Part Number: SMD_PAD_1.27X1.27MM; Component Kind: Standard (No BOM); Component Type: Standard (No BOM); Pin Count: 1; Family: Test Point; Socket: No; SMD: Yes; Sense: No; Status: None; ComponentHeight: 0mm; HelpURL: Undefined; Author: CERN DEM JLC; CreateDate: 12.01.2008; LatestRevisionDate: 12.01.2008; PackageDescription: 1.27mm x 1.27mm PCB Copper Area (SMD Test Point)

## Sheet clk_supply.SchDoc: =ProjectName
size 420 x 297 mm; Author: T.P.; CompanyName: WUT; DrawnBy: T.P.; Organization: WUT ISE; Address1: Warsaw Univeristy of Technology; Address2: Nowowiejska 15/19; DocumentNumber: 25; Revision: 0.9; SheetNumber: 25; SheetTotal: 36; EDA_Number: ARTIQ; Projet: ARTIQ/SINARA; ModifiedBy: -; CreateDate: XX/XX/XXXX; CheckedDate: -; Title2: clk_supply.SchDoc; DivGrp: ISE; Designer: G.K. and T.P.; ModifiedDate: -; ProjectName: ADC/DAC MEZZANINE
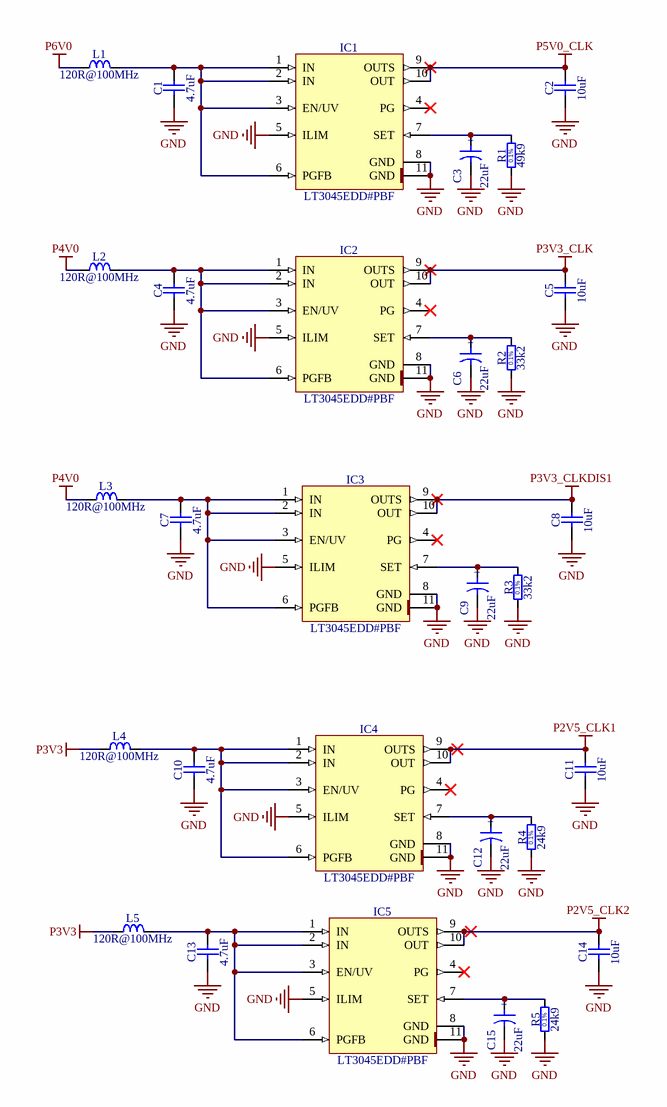
[diagram p7: clk_supply.SchDoc]

### Parts
C1  4.7uF  [CAPC1608X90N]
C2  10uF  [CAPC1608X87N]
C3  22uF  [CAPMP3216X180N]
C4  4.7uF  [CAPC1608X90N]
C5  10uF  [CAPC1608X87N]
C6  22uF  [CAPMP3216X180N]
C7  4.7uF  [CAPC1608X90N]
C8  10uF  [CAPC1608X87N]
C9  22uF  [CAPMP3216X180N]
C10  4.7uF  [CAPC1608X90N]
C11  10uF  [CAPC1608X87N]
C12  22uF  [CAPMP3216X180N]
C13  4.7uF  [CAPC1608X90N]
C14  10uF  [CAPC1608X87N]
C15  22uF  [CAPMP3216X180N]
IC1  LT3045EDD#PBF  [SON50P300X300X80-11N-R175X248]
IC2  LT3045EDD#PBF  [SON50P300X300X80-11N-R175X248]
IC3  LT3045EDD#PBF  [SON50P300X300X80-11N-R175X248]
IC4  LT3045EDD#PBF  [SON50P300X300X80-11N-R175X248]
IC5  LT3045EDD#PBF  [SON50P300X300X80-11N-R175X248]
L1  120R@100MHz  [INDC1608X95N]
L2  120R@100MHz  [INDC1608X95N]
L3  120R@100MHz  [INDC1608X95N]
L4  120R@100MHz  [INDC1608X95N]
L5  120R@100MHz  [INDC1608X95N]
R1  49k9  [RESC1608X55N]
R2  33k2  [RESC1608X55N]
R3  33k2  [RESC1608X55N]
R4  24k9  [RESC1608X55N]
R5  24k9  [RESC1608X55N]

### Nets
GND: C1.1 C2.1 C3.2 C4.1 C5.1 C6.2 C7.1 C8.1 C9.2 C10.1 C11.1 C12.2 C13.1 C14.1 C15.2 IC1.5(ILIM) IC1.8(GND) IC1.11(GND) IC2.5(ILIM) IC2.8(GND) IC2.11(GND) IC3.5(ILIM) IC3.8(GND) IC3.11(GND) IC4.5(ILIM) IC4.8(GND) IC4.11(GND) IC5.5(ILIM) IC5.8(GND) IC5.11(GND) R1.1 R2.1 R3.1 R4.1 R5.1
P2V5_CLK1: C11.2 IC4.9(OUTS) IC4.10(OUT)
P2V5_CLK2: C14.2 IC5.9(OUTS) IC5.10(OUT)
P3V3: L4.1 L5.1
P3V3_CLK: C5.2 IC2.9(OUTS) IC2.10(OUT)
P3V3_CLKDIS1: C8.2 IC3.9(OUTS) IC3.10(OUT)
P4V0: L2.1 L3.1
P5V0_CLK: C2.2 IC1.9(OUTS) IC1.10(OUT)
P6V0: L1.1
NetC1_2: C1.2 IC1.1(IN) IC1.2(IN) IC1.3(EN/UV) IC1.6(PGFB) L1.2
NetC3_1: C3.1 IC1.7(SET) R1.2
NetC4_2: C4.2 IC2.1(IN) IC2.2(IN) IC2.3(EN/UV) IC2.6(PGFB) L2.2
NetC6_1: C6.1 IC2.7(SET) R2.2
NetC7_2: C7.2 IC3.1(IN) IC3.2(IN) IC3.3(EN/UV) IC3.6(PGFB) L3.2
NetC9_1: C9.1 IC3.7(SET) R3.2
NetC10_2: C10.2 IC4.1(IN) IC4.2(IN) IC4.3(EN/UV) IC4.6(PGFB) L4.2
NetC12_1: C12.1 IC4.7(SET) R4.2
NetC13_2: C13.2 IC5.1(IN) IC5.2(IN) IC5.3(EN/UV) IC5.6(PGFB) L5.2
NetC15_1: C15.1 IC5.7(SET) R5.2

Not connected (* = marked no-connect by the designer): IC1 4(PG)*; IC2 4(PG)*; IC3 4(PG)*; IC4 4(PG)*; IC5 4(PG)*

### Notes on the sheet
- Project/Equipment
- Document
- Designer
- Drawn by
- Check.by
- File
- Last Mod.
- Print Date
- Sheet
- Size
- A3
- of
- Rev
- (in symbol CTE3216-18_22UF_6.3V_10%_LESR0900) +
- (in symbol R0603_24K9_0.1%_0.063W_10PPM) 0.1%
- (in symbol R0603_33K2_0.1%_0.063W_10PPM) 0.1%
- (in symbol R0603_49K9_0.1%_0.063W_10PPM) 0.1%

### Library data of the parts
C1 C4 C7 C10 C13 = CC0603_4.7UF_25V_10%_X5R: Non-polarised capacitor; Part Description: SMD Multilayer Chip Ceramic Capacitor; Manufacturer: GENERIC; Manufacturer1 Part Number: GRM188R61E475KE11D; Voltage: 25V; TC: X5R; Tolerance: ±10%; Part Number: CC0603_4.7UF_25V_10%_X5R; Component Kind: Standard; Component Type: Standard; Pin Count: 2; Value: 4.7uF; Status: None; Manufacturer Part Number: CC0603_4.7UF_25V_10%_X5R; Case: 0603; Mounted: Yes; Socket: No; SMD: Yes; Sense: No; Manufacturer1 Example: MURATA; Manufacturer1 ComponentHeight: 0.95mm; HelpURL: \\cern.ch\dfs\Applications\Altium\Datasheets\CC0603_MURATA_GRM188R61E475KE11D.pdf; Author: CERN DEM JLC; CreateDate: 10.11.2014; LatestRevisionDate: 10.11.2014
C2 C5 C8 C11 C14 = CC0603_10UF_6.3V_20%_X5R: Non-polarised capacitor; Part Description: SMD Multilayer Chip Ceramic Capacitor; Manufacturer: GENERIC; Manufacturer1 Part Number: C0603C106M9PAC; Voltage: 6.3V; TC: X5R; Tolerance: ±20%; Part Number: CC0603_10UF_6.3V_20%_X5R; Component Kind: Standard; Component Type: Standard; Pin Count: 2; Value: 10uF; Status: Preferred; Manufacturer Part Number: CC0603_10uF_6.3V_20%_X5R; Case: 0603; Mounted: Yes; Socket: No; SMD: Yes; Sense: No; Manufacturer1 Example: KEMET; Manufacturer1 ComponentHeight: 0.95mm; HelpURL: \\cern.ch\dfs\Applications\Altium\Datasheets\CC0603_X5R_KEMET.pdf; Author: CERN DEM JLC; CreateDate: 03.12.2007; LatestRevisionDate: 03.12.2007
C3 C6 C9 C12 C15 = CTE3216-18_22UF_6.3V_10%_LESR0900: Polarised capacitor; Part Description: Low ESR 0R9 Solid Tantalum Chip Capacitor; Manufacturer: GENERIC; Manufacturer1 Part Number: TPSA226K006R0900; Voltage: 6.3V; Tolerance: ±10%; Part Number: CTE3216-18_22UF_6.3V_10%_LESR0900; Component Kind: Standard; Component Type: Standard; Pin Count: 2; Value: 22uF; Status: Preferred; Manufacturer Part Number: CTE3216-18_22UF_6.3V_10%_LESR0900; Case: A; Mounted: Yes; Socket: No; SMD: Yes; Sense: No; Manufacturer1 Example: AVX; Manufacturer1 ComponentHeight: 1.8mm; HelpURL: \\cern.ch\dfs\Applications\Altium\Datasheets\CTE-LESR_AVX_TPS.pdf; Author: CERN DEM JLC; CreateDate: 05.05.2008; LatestRevisionDate: 20.01.2009
IC1-IC5 = LT3045EDD#PBF: 20V, 500mA, Ultralow Noise, Ultrahigh PSRR Linear Regulator; Manufacturer: LINEAR TECHNOLOGY; PressFit: No; Bonding: No; Part Number: LT3045EDD#PBF; Component Kind: Standard; Component Type: Standard; Device: LT3045EDD#PBF; PackageDescription: SON, 0.50mm Pitch, 10-pin, 3.00mm W  X 3.00mm L X 0.80mm Height, (w/thermal tab 1.75 X 2.48 mm), IPC Medium Density; Part Description: 20V, 500mA, Ultralow Noise, Ultrahigh PSRR Linear Regulator; Manufacturer Part Number: LT3045EDD#PBF; Pin Count: 11; Case: SON10; Mounted: Yes; Socket: No; SMD: Yes; Sense: No; ComponentHeight: 0.8mm; HelpURL: \\cern.ch\dfs\Applications\Altium\Datasheets\LT3045EDD#PBF.pdf; Author: CERN DEM JLC; CreateDate: 07.12.2016; LatestRevisionDate: 07.12.2016
L1-L5 = IND0603_MURATA_BLM18PG121SN1D: Inductor; Part Description: SMD EMIFIL Chip Ferrite Bead; Manufacturer: MURATA; Power: 2A; Resistance: 0.05R; Part Number: IND0603_MURATA_BLM18PG121SN1D; Component Kind: Standard; Component Type: Standard; Pin Count: 2; Value: 120R@100MHz; Status: None; Manufacturer Part Number: BLM18PG121SN1D; Case: 0603; Mounted: Yes; Socket: No; SMD: Yes; Sense: No; ComponentHeight: 0.95mm; HelpURL: \\cern.ch\dfs\Applications\Altium\Datasheets\IND0603_MURATA_BLM18P.pdf; Author: CERN DEM BC; CreateDate: 27.07.2015; LatestRevisionDate: 27.07.2015
R1 = R0603_49K9_0.1%_0.063W_10PPM: Resistor - 0.1%; Part Description: Thin Film Chip Resistor; Manufacturer: GENERIC; Manufacturer1 Part Number: RN73C1J49K9BTDF; Power: 0.063W; TC: ±10ppm; PressFit: No; Part Number: R0603_49K9_0.1%_0.063W_10PPM; Component Kind: Standard; Component Type: Standard; Pin Count: 2; Value: 49k9; Status: Not Recommended; Tolerance: ±0.1%; Manufacturer Part Number: R0603_49K9_0.1%_0.063W_10PPM; Case: 0603; Mounted: Yes; Sense: No; Socket: No; SMD: Yes; Manufacturer1 Example: TYCO HOLSWORTHY; Manufacturer1 ComponentHeight: 0.5mm; HelpURL: \\cern.ch\dfs\Applications\Altium\Datasheets\R0603_Tyco_RN73.pdf; Author: CERN DEM JLC; CreateDate: 03.12.2007; LatestRevisionDate: 13.03.2008
R2 R3 = R0603_33K2_0.1%_0.063W_10PPM: Resistor - 0.1%; Part Description: Thin Film Chip Resistor; Manufacturer: GENERIC; Manufacturer1 Part Number: RN73C1J33K2BTDF; Power: 0.063W; TC: ±10ppm; PressFit: No; Part Number: R0603_33K2_0.1%_0.063W_10PPM; Component Kind: Standard; Component Type: Standard; Pin Count: 2; Value: 33k2; Status: Not Recommended; Tolerance: ±0.1%; Manufacturer Part Number: R0603_33K2_0.1%_0.063W_10PPM; Case: 0603; Mounted: Yes; Sense: No; Socket: No; SMD: Yes; Manufacturer1 Example: TYCO HOLSWORTHY; Manufacturer1 ComponentHeight: 0.5mm; HelpURL: \\cern.ch\dfs\Applications\Altium\Datasheets\R0603_Tyco_RN73.pdf; Author: CERN DEM JLC; CreateDate: 03.12.2007; LatestRevisionDate: 13.03.2008
R4 R5 = R0603_24K9_0.1%_0.063W_10PPM: Resistor - 0.1%; Part Description: Thin Film Chip Resistor; Manufacturer: GENERIC; Manufacturer1 Part Number: RN73C1J24K9BTDF; Power: 0.063W; TC: ±10ppm; PressFit: No; Part Number: R0603_24K9_0.1%_0.063W_10PPM; Component Kind: Standard; Component Type: Standard; Pin Count: 2; Value: 24k9; Status: Not Recommended; Tolerance: ±0.1%; Manufacturer Part Number: R0603_24K9_0.1%_0.063W_10PPM; Case: 0603; Mounted: Yes; Sense: No; Socket: No; SMD: Yes; Manufacturer1 Example: TYCO HOLSWORTHY; Manufacturer1 ComponentHeight: 0.5mm; HelpURL: \\cern.ch\dfs\Applications\Altium\Datasheets\R0603_Tyco_RN73.pdf; Author: CERN DEM JLC; CreateDate: 03.12.2007; LatestRevisionDate: 13.03.2008